# Altium schematic sheet THERMAL_MANAGEMENT.SchDoc
size A4
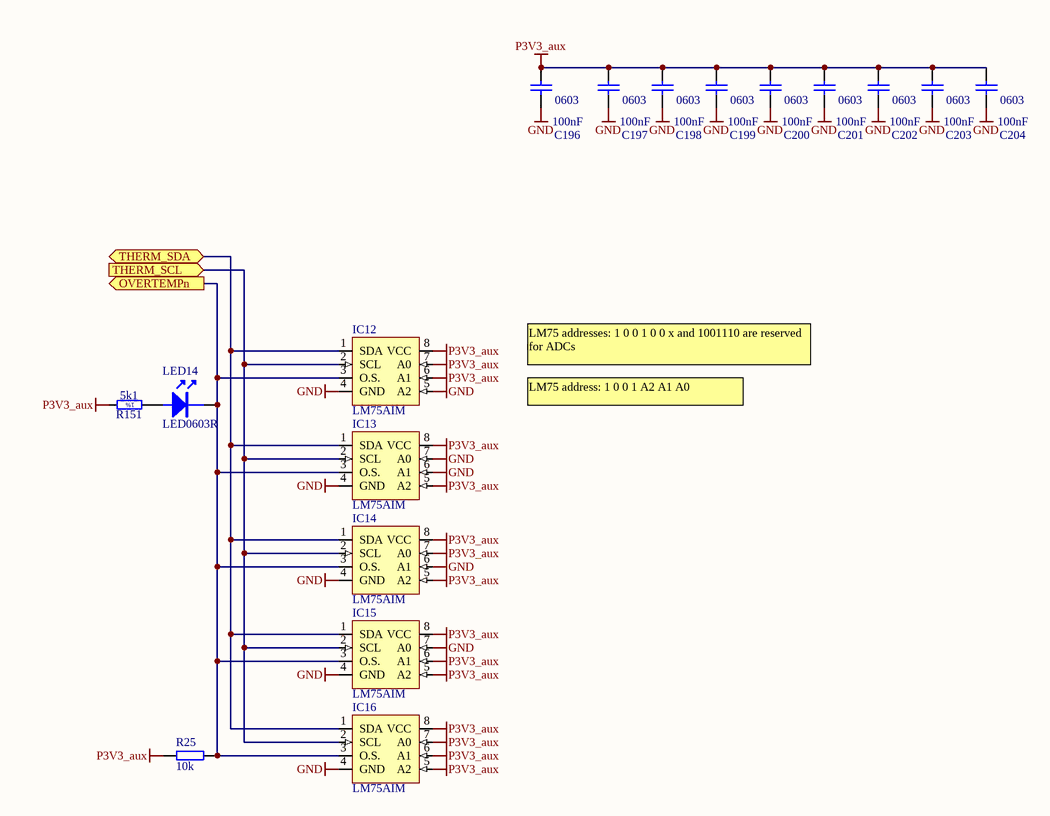
[diagram p0: THERMAL_MANAGEMENT.SchDoc]

## Parts
C196  100nF  Case: 0603  [0402C]
C197  100nF  Case: 0603  [0402C]
C198  100nF  Case: 0603  [0402C]
C199  100nF  Case: 0603  [0402C]
C200  100nF  Case: 0603  [0402C]
C201  100nF  Case: 0603  [0402C]
C202  100nF  Case: 0603  [0402C]
C203  100nF  Case: 0603  [0402C]
C204  100nF  Case: 0603  [0402C]
IC12  LM75AIM  [SOIC127P600X175-8N]
IC13  LM75AIM  [SOIC127P600X175-8N]
IC14  LM75AIM  [SOIC127P600X175-8N]
IC15  LM75AIM  [SOIC127P600X175-8N]
IC16  LM75AIM  [SOIC127P600X175-8N]
LED14  LED0603R  [led_0603]
R25  10k  [0402R]
R151  5k1  [0603R]

## Ports
OVERTEMPn (out), THERM_SCL (in), THERM_SDA (bidir)

## Nets
GND: C196.2 C197.2 C198.2 C199.2 C200.2 C201.2 C202.2 C203.2 C204.2 IC12.4(GND) IC12.5(A2) IC13.4(GND) IC13.6(A1) IC13.7(A0) IC14.4(GND) IC14.6(A1) IC15.4(GND) IC15.7(A0) IC16.4(GND)
P3V3_aux: C196.1 C197.1 C198.1 C199.1 C200.1 C201.1 C202.1 C203.1 C204.1 IC12.6(A1) IC12.7(A0) IC12.8(VCC) IC13.5(A2) IC13.8(VCC) IC14.5(A2) IC14.7(A0) IC14.8(VCC) IC15.5(A2) IC15.6(A1) IC15.8(VCC) IC16.5(A2) IC16.6(A1) IC16.7(A0) IC16.8(VCC) R25.1 R151.2
OVERTEMPn: IC12.3(O.S.) IC13.3(O.S.) IC14.3(O.S.) IC15.3(O.S.) IC16.3(O.S.) LED14.K R25.2 ; port OVERTEMPn
THERM_SCL: IC12.2(SCL) IC13.2(SCL) IC14.2(SCL) IC15.2(SCL) IC16.2(SCL) ; port THERM_SCL
THERM_SDA: IC12.1(SDA) IC13.1(SDA) IC14.1(SDA) IC15.1(SDA) IC16.1(SDA) ; port THERM_SDA
NetLED14_A: LED14.A R151.1

## Notes on the sheet
- LM75 addresses: 1 0 0 1 0 0 x and 1001110 are reserved for ADCs
- LM75 address: 1 0 0 1 A2 A1 A0
- (in symbol R0603_5K1_1%_0.1W_100PPM) 1%

## Library data of the parts
C196-C204 = CC0603_100NF_50V_10%_X7R: Non-polarised capacitor; Part Description: SMD Multilayer Chip Ceramic Capacitor; Manufacturer: GENERIC; Manufacturer1 Part Number: 223858615649; Voltage: 50V; TC: X7R; Tolerance: ±10%; Table: Capacitors SMD; Part Number: CC0603_100NF_50V_10%_X7R; Component Kind: Standard; Component Type: Standard; Footprint: CAPC1608X87N; Pin Count: 2; Value: 100nF; Status: Preferred; Manufacturer Part Number: CC0603_100NF_50V_10%_X7R; Mounted: Yes; Socket: No; SMD: Yes; Manufacturer1 Example: PHYCOMP; Manufacturer1 ComponentHeight: 0.87mm; HelpURL: \\cern.ch\dfs\Applications\Altium\Datasheets\CC0603_X7R_PHYCOMP.pdf; Author: CERN DEM JLC; CreateDate: 2007-12-03; LatestRevisionDate: 2007-12-03
IC12-IC16 = SENS_LM75: I2C temperature sensor
LED14 = LED_SMD: LED
R25 = RES_SMD: SMD Resistor
R151 = R0603_5K1_1%_0.1W_100PPM: Resistor - 1%; Part Description: General Purpose Thick Film Chip Resistor; Manufacturer: GENERIC; Manufacturer1 Part Number: NRC06F5101TRF; Power: 0.1W; TC: ±100ppm/°C; Table: Resistors SMD; Part Number: R0603_5K1_1%_0.1W_100PPM; Component Kind: Standard; Component Type: Standard; Footprint: RESC1608X55N; Pin Count: 2; Value: 5k1; Status: Preferred; Tolerance: ±1%; Manufacturer Part Number: R0603_5K1_1%_0.1W_100PPM; Case: 0603; Mounted: Yes; Socket: No; SMD: Yes; Manufacturer1 Example: NIC COMPONENT; Manufacturer1 ComponentHeight: 0.55mm; HelpURL: \\cern.ch\dfs\Applications\Altium\Datasheets\R0603_NIC_NRC.pdf; Author: CERN DEM JLC; CreateDate: 2007-12-03; LatestRevisionDate: 2008-03-13